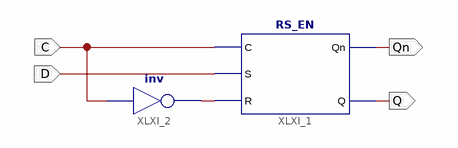
[diagram p0: schematic sheet 1]
// Xilinx ISE schematic D_EN.sch (kintex7) as structural Verilog: 2 symbols, 4 ports
module D_EN (
  input  C,
  input  D,
  output Qn,
  output Q
);

  wire XLXN_1;

  RS_EN XLXI_1 (.C(C), .S(D), .R(XLXN_1), .Qn(Qn), .Q(Q));
  not XLXI_2 (XLXN_1, C);
endmodule
